# EAGLE design dds_shield_jfet (EAGLE 7.2.0)
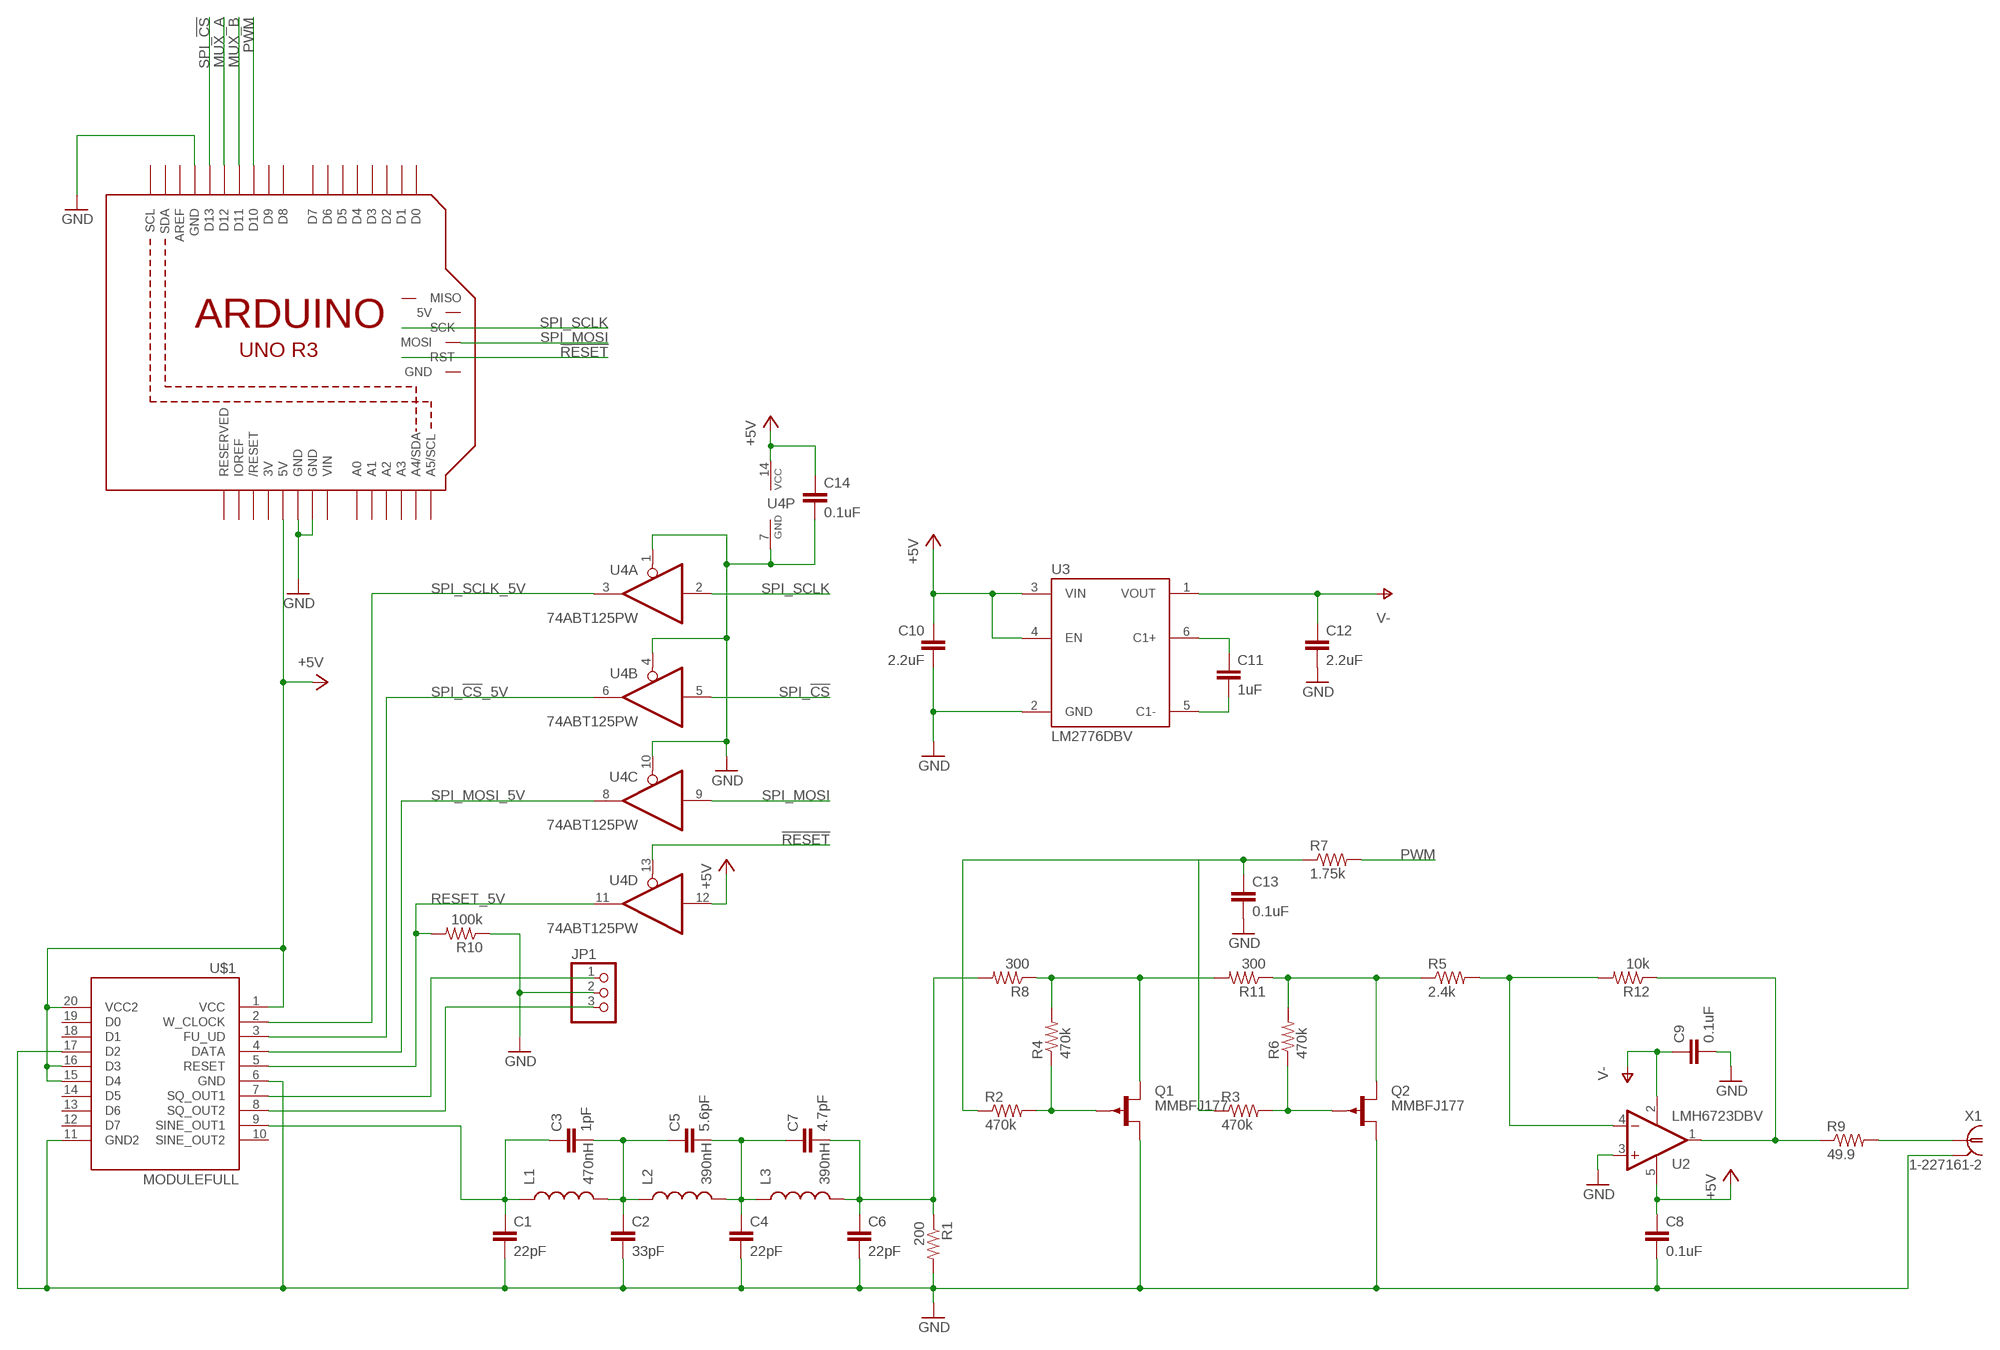
[diagram p0: schematic, sheet 1]

## Parts
C1  22pF  C-EUC0603  [C0603]
C2  33pF  C-EUC0603  [C0603]
C3  1pF  C-EUC0603  [C0603]
C4  22pF  C-EUC0603  [C0603]
C5  5.6pF  C-EUC0603  [C0603]
C6  22pF  C-EUC0603  [C0603]
C7  4.7pF  C-EUC0603  [C0603]
C8  0.1uF  C-EUC0603  [C0603]
C9  0.1uF  C-EUC0603  [C0603]
C10  2.2uF  C-EUC0603  [C0603]
C11  1uF  C-EUC0603  [C0603]
C12  2.2uF  C-EUC0603  [C0603]
C13  0.1uF  C-EUC0603  [C0603]
C14  0.1uF  C-EUC0603  [C0603]
JP1  PINHD-1X3/90  [1X03/90]
L1  470nH  INDUCTOR0603  [0603]
L2  390nH  INDUCTOR0603  [0603]
L3  390nH  INDUCTOR0603  [0603]
M1  ARDUINO_R3_ICSP  [ARDUINOR3_ICSP]
Q1  MMBFJ177  [SOT23]
Q2  MMBFJ177  [SOT23]
R1  200  R-US_R0603  [R0603]
R2  470k  R-US_R0603  [R0603]
R3  470k  R-US_R0603  [R0603]
R4  470k  R-US_R0603  [R0603]
R5  2.4k  R-US_R0603  [R0603]
R6  470k  R-US_R0603  [R0603]
R7  1.75k  R-US_R0603  [R0603]
R8  300  R-US_R0603  [R0603]
R9  49.9  R-US_R0603  [R0603]
R10  100k  R-US_R0603  [R0603]
R11  300  R-US_R0603  [R0603]
R12  10k  R-US_R0603  [R0603]
U2  LMH6723DBV  [SOT23-DBV]
U3  LM2776DBV  [SOT23-6]
U4  74ABT125PW  [TSSOP14]
U$1  MODULEFULL  [MODULE]
X1  1-227161-2  [AMP_227161]

## Nets
!RESET: M1.RESET_ICSP(RST) U4.13(D:OE)
+5V: C8.1 C10.1 C14.1 M1.5V U2.5(V+) U3.3(VIN) U3.4(EN) U4.12(D:I) U4.14(P:VCC) U$1.1(VCC) U$1.15(D4) U$1.16(D3) U$1.20(VCC2)
GND: C1.2 C2.2 C4.2 C6.2 C8.2 C9.2 C10.2 C12.2 C13.2 C14.2 JP1.2 M1.GND M1.GND@1(GND) M1.GND@3(GND) Q1.1(D) Q2.1(D) R1.2 R10.1 U2.3(+IN) U3.2(GND) U4.1(A:OE) U4.4(B:OE) U4.7(P:GND) U4.10(C:OE) U$1.6(GND) U$1.11(GND2) U$1.17(D2) X1.2
MUX_A: M1.D12
MUX_B: M1.D11
N$1: C1.1 C3.1 L1.1 U$1.9(SINE_OUT1)
N$2: Q2.3(G) R3.2 R6.1
N$3: C2.1 C3.2 C5.1 L1.2 L2.1
N$4: C4.1 C5.2 C7.1 L2.2 L3.1
N$5: Q1.3(G) R2.2 R4.1
N$6: C13.1 R2.1 R3.1 R7.1
N$7: R5.2 R12.2 U2.4(-IN)
N$8: C6.1 C7.2 L3.2 R1.1 R8.2
N$9: Q2.2(S) R5.1 R6.2 R11.1
N$10: Q1.2(S) R4.2 R8.1 R11.2
N$12: R9.1 R12.1 U2.1(OUT)
N$13: R9.2 X1.1
N$14: JP1.1 U$1.7(SQ_OUT1)
N$15: C11.1 U3.6(C1+)
N$16: C11.2 U3.5(C1-)
N$17: JP1.3 U$1.8(SQ_OUT2)
PWM: M1.D10 R7.2
RESET_5V: R10.2 U4.11(D:O) U$1.5(RESET)
SPI_!CS: M1.D13 U4.5(B:I)
SPI_!CS!_5V: U4.6(B:O) U$1.3(FU_UD)
SPI_MOSI: M1.MOSI U4.9(C:I)
SPI_MOSI_5V: U4.8(C:O) U$1.4(DATA)
SPI_SCLK: M1.SCK U4.2(A:I)
SPI_SCLK_5V: U4.3(A:O) U$1.2(W_CLOCK)
V-: C9.1 C12.1 U2.2(V-) U3.1(VOUT)
Unconnected: M1.5V_ICSP(5V) M1.A0 M1.A1 M1.A2 M1.A3 M1.A4(A4/SDA) M1.A5(A5/SCL) M1.AREF M1.D0 M1.D1 M1.D2 M1.D3 M1.D4 M1.D5 M1.D6 M1.D7 M1.D8 M1.D9 M1.GND@2(GND) M1.IOREF M1.MISO M1.RESERVED M1.RESET(/RESET) M1.SCL M1.SDA U$1.10(SINE_OUT2) U$1.12(D7) U$1.13(D6) U$1.14(D5) U$1.18(D1) U$1.19(D0)

## Power pins joined to a net without a drawn wire
3V: M1.3V
VIN: M1.VIN

## Library data of the parts
C1-C14 = rcl:C-EU: CAPACITOR, European symbol
JP1 = pinhead:PINHD-1X3: PIN HEADER
L1-L3 = SparkFun:INDUCTOR: Inductors Basic Inductor/Choke - 0603 and 1206. Footprints are not proven and vary greatly between part numbers.
M1 = adafruit:ARDUINO_R3_ICSP
Q1 Q2 = transistors:MMBFJ177
R1-R12 = rcl:R-US_: RESISTOR, American symbol
U2 = LMH6723:LMH6723
U3 = lm2776:LM2776
U4 = 74xx-eu:74*125: Quad bus BUFFER, 3-state
U$1 = DDS Module:MODULE: AD9850 DDS Module, widely available on eBay for very low cost
X1 = con-coax:?227161*: JACK, RIGHT ANGLE, 50 OHM, PCB, BNC Source: amp_227161.pdf; OC_FARNELL: unknown; OC_NEWARK: unknown

## Board
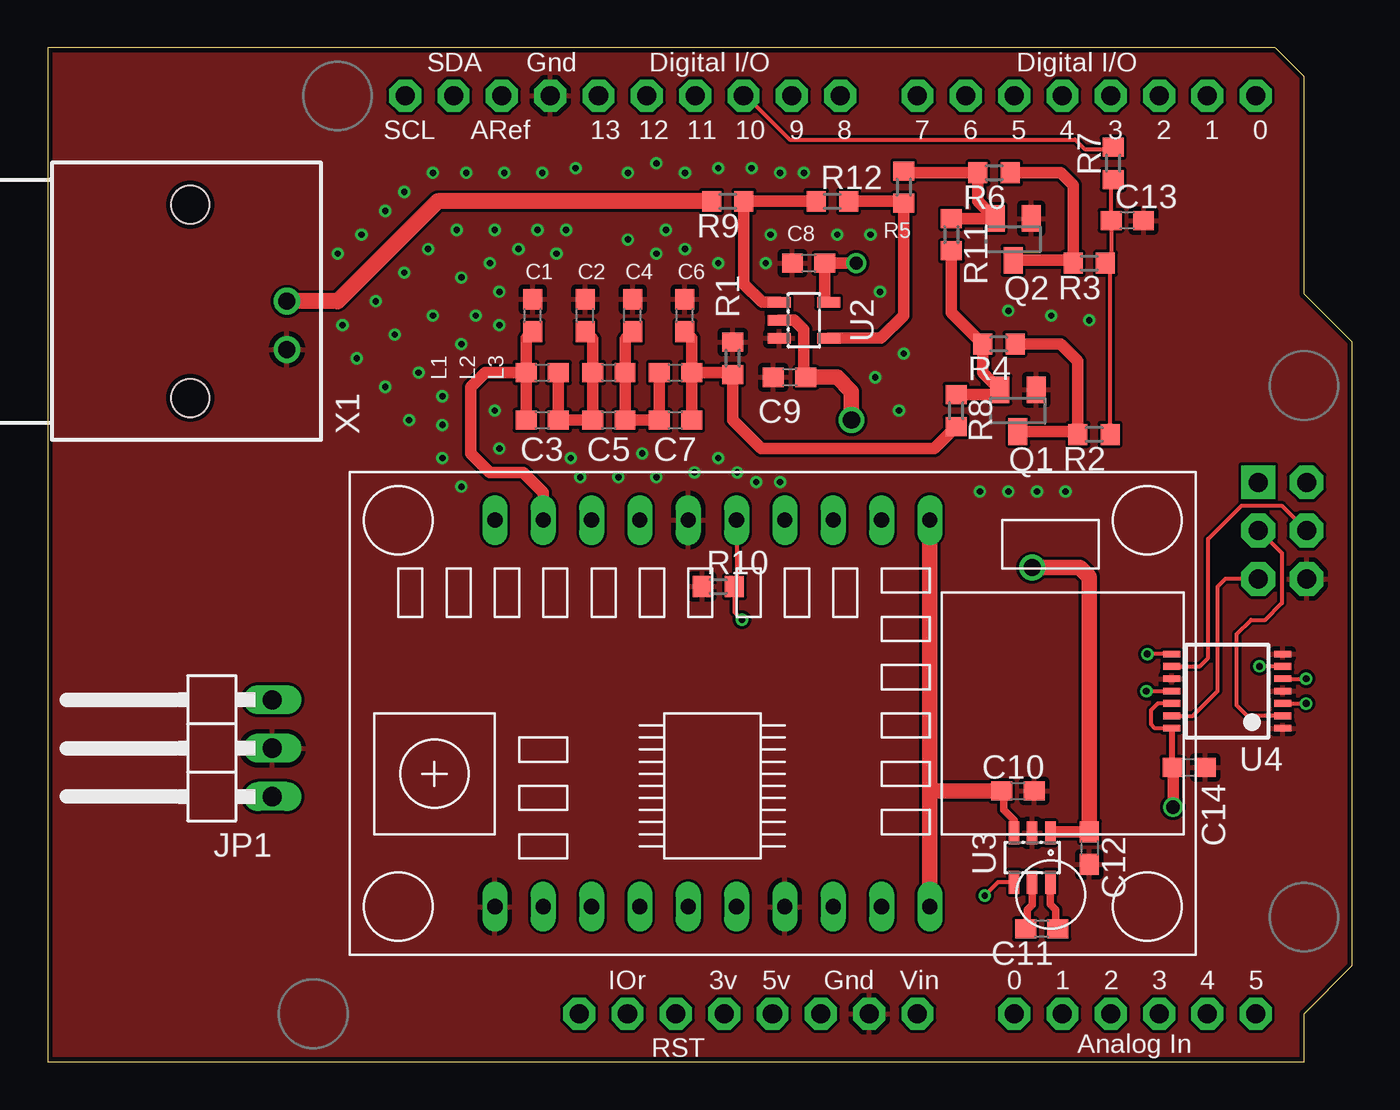
[diagram p1: board, top side]
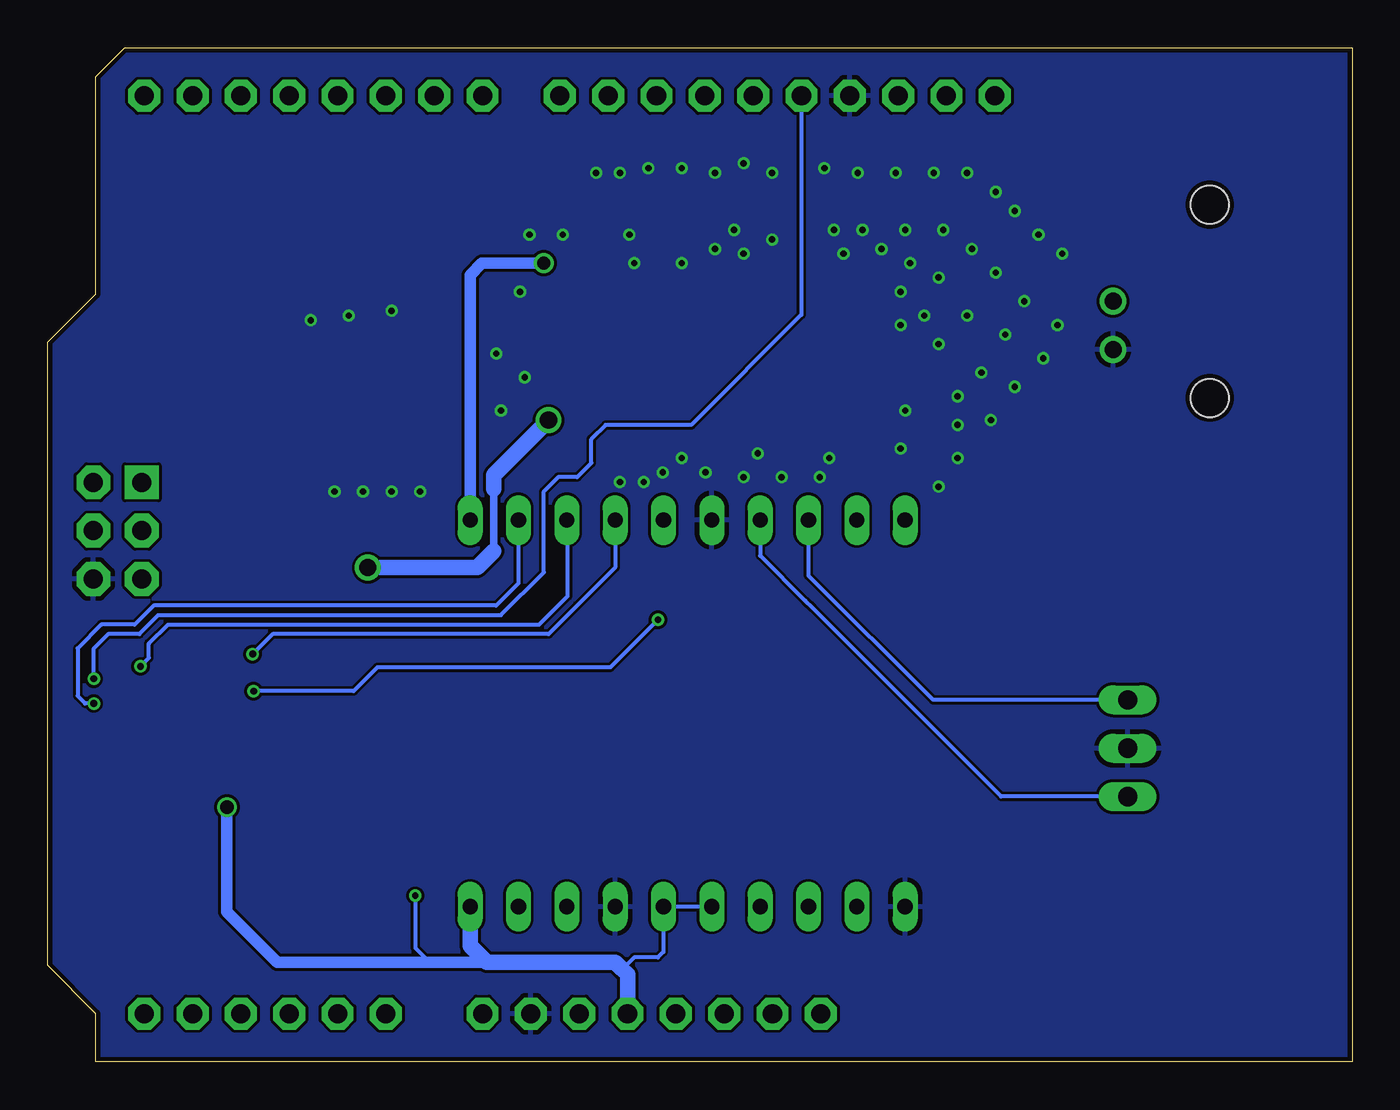
[diagram p2: board, bottom side, seen from below]

Size 68.58 x 53.34 mm. Coordinates in mm from the lower left corner, seen from the top.
Outline: 0,50.79 0,2.54
Copper layers (1*16): Top 0.035mm / dielectric 1.5mm / Bottom 0.035mm
Design rules "ITEADstudio_DRC": minimum track width 6mil, minimum drill 12mil, track to track 6mil, track to pad 6mil, pad to pad 6mil, via to via 6mil, smd to smd 0mil, copper to edge 10mil, drill to drill 10mil, minimum pad ring 10mil, minimum via ring 6mil, stop-mask expansion 2mil, vias tented up to drill 100mil, thermal gap 10mil

### Footprints (pad centres in the part's own frame; a part is rotated, then mirrored left to right if it is on the bottom)
C0603 = smd 1.1 x 1: 1 -0.85,0; 2 0.85,0
1X03/90 = drill 1.016 long: 1 -2.54,-3.81; 2 0,-3.81; 3 2.54,-3.81
0603 = smd 1.1 x 1: 1 -0.85,0; 2 0.85,0
ARDUINOR3_ICSP = drill 1 pad 1.676 octagon: 3V 35.56,2.54; 5V 38.1,2.54; A0 50.8,2.54; A1 53.34,2.54; A2 55.88,2.54; A3 58.42,2.54; A4 60.96,2.54; A5 63.5,2.54; AREF 23.876,50.8; D0 63.5,50.8; D1 60.96,50.8; D2 58.42,50.8; D3 55.88,50.8; D4 53.34,50.8; D5 50.8,50.8; D6 48.26,50.8; D7 45.72,50.8; D8 41.656,50.8; D9 39.116,50.8; D10 36.576,50.8; D11 34.036,50.8; D12 31.496,50.8; D13 28.956,50.8; GND 26.416,50.8; GND@1 43.18,2.54; GND@2 40.64,2.54; IOREF 30.48,2.54; RESERVED 27.94,2.54; RESET 33.02,2.54; SCL 18.796,50.8; SDA 21.336,50.8; VIN 45.72,2.54 | drill 1 pad 1.778 octagon: 5V_ICSP 66.167,30.48; GND@3 66.167,25.4; MOSI 66.167,27.94; RESET_ICSP 63.627,25.4; SCK 63.627,27.94 | drill 1 pad 1.778 square: MISO 63.627,30.48
SOT23 = smd 1 x 1.4: 1 -0.95,-1.1; 2 0.95,-1.1; 3 0,1.1
R0603 = smd 1 x 1.1: 1 -0.85,0; 2 0.85,0
SOT23-DBV = smd 0.55 x 1.2: 1 -0.95,-1.3; 2 0,-1.3; 3 0.95,-1.3; 4 0.95,1.3; 5 -0.95,1.3
SOT23-6 = smd 0.55 x 1.2: 1 -0.95,-1.3; 2 0,-1.3; 3 0.95,-1.3; 4 0.95,1.3; 5 0,1.3; 6 -0.95,1.3
TSSOP14 = smd 0.35 x 0.9: 1 -1.95,-2.925; 2 -1.3,-2.925; 3 -0.65,-2.925; 4 0,-2.925; 5 0.65,-2.925; 6 1.3,-2.925; 7 1.95,-2.925; 8 1.95,2.925; 9 1.3,2.925; 10 0.65,2.925; 11 0,2.925; 12 -0.65,2.925; 13 -1.3,2.925; 14 -1.95,2.925
MODULE = drill 0.8 long: 1 -10.16,11.43; 2 -10.16,8.89; 3 -10.16,6.35; 4 -10.16,3.81; 5 -10.16,1.27; 6 -10.16,-1.27; 7 -10.16,-3.81; 8 -10.16,-6.35; 9 -10.16,-8.89; 10 -10.16,-11.43; 11 10.16,-11.43; 12 10.16,-8.89; 13 10.16,-6.35; 14 10.16,-3.81; 15 10.16,-1.27; 16 10.16,1.27; 17 10.16,3.81; 18 10.16,6.35; 19 10.16,8.89; 20 10.16,11.43
AMP_227161 = drill 0.9 pad 1.27: 1 0,-5.08; 2 -2.54,-5.08 | hole 2: -5.08,0; 5.08,0

### Placement (x,y rotation side)
C1  25.5,39.25 90 top
C2  28.25,39.25 90 top
C3  26,33.75 0 top
C4  30.75,39.25 90 top
C5  29.5,33.75 0 top
C6  33.5,39.25 90 top
C7  33,33.75 0 top
C8  40,42 180 top
C9  39,36 180 top
C10  51,14.25 0 top
C11  52.25,7 180 top
C12  54.75,11.25 270 top
C13  56.75,44.25 0 top
C14  60,15.5 0 top
JP1  8,16.5 90 top
L1  26,36.25 0 top
L2  29.5,36.25 0 top
L3  33,36.25 0 top
M1  0,0 0 top
Q1  51,34.25 180 top
Q2  50.75,43.25 180 top
R1  36,37 90 top
R2  55,33 180 top
R3  54.75,42 180 top
R4  50,37.75 180 top
R5  45,46 270 top
R6  49.75,46.75 180 top
R7  56,47.25 90 top
R8  47.75,34.25 270 top
R9  35.75,45.25 180 top
R10  35.25,25 0 top
R11  47.5,43.5 270 top
R12  41.25,45.25 0 top
U2  39.75,39 270 top
U3  51.75,10.75 180 top
U4  62,19.5 90 top
U$1  34.94,18.33 270 top
X1  7.5,40 90 top

### Tracks (layer width: path | path; a pad name or v marks a point on that pad's centre or on a via)
!RESET
  Top 0.203: U4.13 60.2,18.2 61.5,19.5 61.5,25 61.9,25.4 M1.RESET_ICSP
+5V  (via drill 0.33, 0.7)
  Top 0.203: U4.14 58.2,17.55 58,17.75 58,18.5 58.35,18.85 U4.12 | U3.4 49.95,9.45 v49.25,8.75
  Top 0.305: U4.14 59.08,15.57 C14.1
  Top 0.406: U3.3 50.8,12.7 50.25,13.25 50.25,14.15 C10.1
  Top 0.61: C14.1 v59.15,13.4 | v42.5,42 C8.1 40.85,40.15 U2.5
  Top 0.813: U$1.1 46.37,14.25 | 46.37,14.25 U$1.20 | C10.1 46.37,14.25
  Bottom 0.203: U$1.15 U$1.16 36.21,5.79 36.5,5.5 37.75,5.5 38.38,4.88 | v49.25,8.75 49.25,6 48.5,5.25
  Bottom 0.61: 45.5,5.25 48.5,5.25 56.5,5.25 59.15,7.9 v59.15,13.4 | U$1.1 46.37,41.38 45.75,42 v42.5,42
  Bottom 0.813: M1.5V 38.1,4.6 38.38,4.88 38.75,5.25 45.5,5.25 46.37,6.12 U$1.20
GND  (via drill 0.33)
  other vias: 20.75,33.5 20.75,31.75 21.75,30.25 23.75,32.25 23.5,34.25 20.75,35 23.75,38.75 21.75,37.75 22.5,39.25 23.75,40.5 24.75,42.75 26.75,42.5 27.25,43.75 30.5,43.25 32,42.5 33.5,42.75 35.25,42 32.5,43.75 33.5,46.75 32,47.25 30.5,46.75 27.75,47 26,46.75 24,46.75 22,46.75 20.25,46.75 18.75,45.75 17.75,44.75 16.5,43.5 15.25,42.5 17.25,40 15.5,38.75 18.75,41.5 20,42.75 21.5,43.75 23.5,43.75 25.75,43.75 35.25,47 37,47 38.5,46.75 39.75,46.75 43.25,43.5 41.5,43.5 38,43.5 37.75,42 35.25,31.75 37.25,30.5 36.25,31 49,30 50.5,30 52,30 53.5,30 20.25,39.25 21.75,41.25 23.25,42 18.25,38.25 19.5,36.25 19,33.75 17.75,35.5 16.25,37 27.5,31.75 31.25,32 30,30.75 28,30.75 32,30.75 34,31 38.5,30.5 44.75,34.25 43.5,36 45,37.25 43.75,40.5 54.75,39 52.75,39.25 50.5,39.5
  pour Top: 0,0 66.04,0 66.04,2.54 68.58,5.08 68.58,38.1 66.04,40.64 66.04,52.07 64.77,53.34 0,53.34
  pour Bottom: 0,0 66.04,0 66.04,2.54 68.58,5.08 68.58,38.1 66.04,40.64 66.04,52.07 64.77,53.34 0,53.34
N$1
  Top 0.61: 25.01,33.61 C3.1 L1.1 | L1.1 23,36.25 22.25,35.5 22.25,32 23.25,31 25,31 26.05,29.95 U$1.9 | L1.1 25.15,38.05 C1.1
N$2
  Top 0.61: Q2.3 53.75,42.15 R3.2 53.9,46.1 53.25,46.75 R6.1
N$3
  Top 0.61: L1.2 C3.2 C5.1 L2.1 28.65,38 C2.1
N$4
  Top 0.61: L3.1 C7.1 C5.2 L2.2 30.35,38 C4.1
N$5
  Top 0.61: Q1.3 54,33.15 R2.2 54.15,36.85 53.25,37.75 R4.1
N$6
  Top 0.203: R2.1 55.85,41.75 R3.1 55.9,42.3 C13.1 55.9,46.3 R7.1
N$7
  Top 0.61: U2.4 43.8,38.05 45,39.25 R5.2 44.9,45.25 R12.2
N$8
  Top 0.61: C7.2 L3.2 | L3.2 33.85,38.05 C6.1 | L3.2 35.9,36.25 R1.1 36,33.75 37.5,32.25 46.6,32.25 R8.2
N$9
  Top 0.61: R11.1 Q2.2 48.9,45.25 R6.2 45.1,46.75 R5.1
N$10
  Top 0.61: R8.1 49.8,35.1 Q1.2 49.15,36.25 R4.2 47.5,39.4 R11.2
N$12
  Top 0.61: R12.1 R9.1 36.6,40.9 37.55,39.95 U2.1
N$13
  Top 0.83: X1.1 15.25,40 20.5,45.25 R9.2
N$14
  Bottom 0.203: JP1.1 18.46,13.96 28.38,23.88 28.75,24.25 31.13,26.63 U$1.7
N$15
  Top 0.406: U3.6 52.7,8.3 53,8 53,7.1 C11.1
N$16
  Top 0.406: U3.5 51.75,8.25 51.5,8 51.5,7.1 C11.2
N$17
  Bottom 0.203: U$1.8 28.59,25.59 22.04,19.04 JP1.3
PWM
  Top 0.203: M1.D10 36.7,50.8 39,48.5 54,48.5 54.5,48 55.9,48 R7.2
RESET_5V  (via drill 0.36)
  Top 0.203: U$1.5 36.21,25.11 R10.2 36.1,23.65 v36.5,23.25 | v57.75,19.5 U4.11
  Bottom 0.203: v36.5,23.25 39,20.75 51.25,20.75 52.5,19.5 v57.75,19.5
SPI_!CS  (via drill 0.36)
  Top 0.203: U4.5 v66.15,20.15
  Bottom 0.203: v66.15,20.15 66.15,21.75 65.4,22.5 63.75,22.5 62.75,23.5 44.75,23.5 42.5,25.75 42.5,30 41.75,30.75 40.75,30.75 40,31.5 40,32.75 39.25,33.5 34.75,33.5 28.96,39.29 M1.D13
SPI_!CS!_5V  (via drill 0.36)
  Top 0.203: U4.6 v63.7,20.8
  Bottom 0.203: U$1.3 41.25,28.45 41.25,24.5 42.75,23 62.25,23 63.25,22 63.25,21.25 v63.7,20.8
SPI_MOSI
  Top 0.203: U4.9 60.55,20.8 61,21.25 61,27.5 62.75,29.25 64.86,29.25 M1.MOSI
SPI_MOSI_5V  (via drill 0.36)
  Top 0.203: U4.8 v57.8,21.45
  Bottom 0.203: U$1.4 38.75,26 42.25,22.5 56.75,22.5 v57.8,21.45
SPI_SCLK
  Top 0.203: M1.SCK 63.69,27.94 64.88,26.75 64.88,24.12 64,23.25 63.25,23.25 62.5,22.5 62.5,18.75 63.05,18.2 U4.2
SPI_SCLK_5V  (via drill 0.36)
  Top 0.203: U4.3 v66.15,18.85
  Bottom 0.203: U$1.2 43.83,25.17 45,24 63,24 64,23 65.75,23 67,21.75 67,19.25 66.6,18.85 v66.15,18.85
V-  (via drill 0.9)
  Top 0.406: 52.75,12.1 U3.1 | 39.75,36.1 C9.1
  Top 0.61: 52.75,12.1 C12.1 | 39.75,36.1 39.75,38.5 39.25,39 U2.2
  Top 0.813: C12.1 54.75,25.5 54.25,26 v51.75,26 | v42.25,33.75 42.25,35.25 41.5,36 C9.1
  Bottom 0.406: 45.12,26.88 45.12,30.12
  Bottom 0.813: v51.75,26 46,26 45.12,26.88 | 45.12,30.12 45.12,30.88 v42.25,33.75